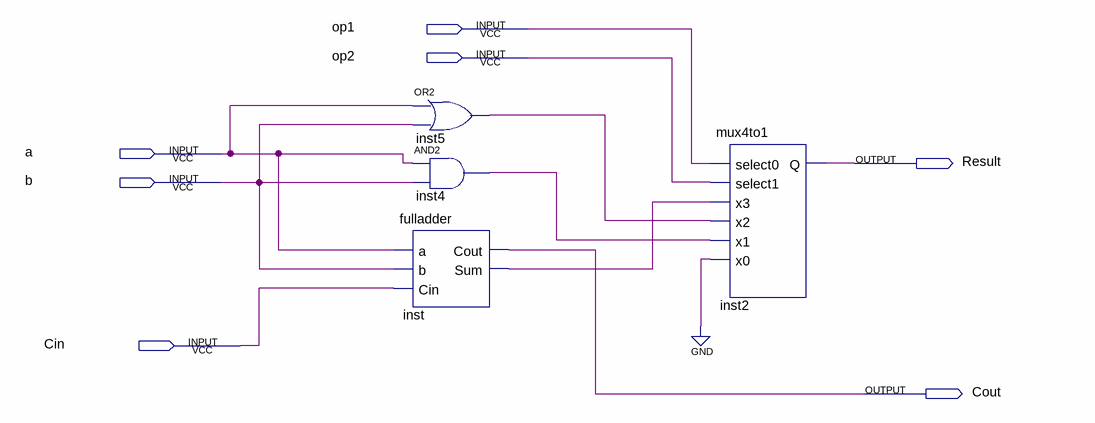
[diagram p0: schematic sheet]
// Quartus schematic alu1bit.bdf as structural Verilog: 4 symbols, 7 pins
module alu1bit (
  input  op1,
  input  op2,
  input  a,
  input  b,
  input  Cin,
  output Result,
  output Cout
);

  wire inst4_out, inst5_out, inst_sum;

  or inst5 (inst5_out, a, b);
  and inst4 (inst4_out, a, b);
  fulladder inst (.a(a), .b(b), .Cin(Cin), .Cout(Cout), .Sum(inst_sum));
  mux4to1 inst2 (.select0(op1), .select1(op2), .x3(inst_sum), .x2(inst5_out), .x1(inst4_out), .x0(1'b0), .Q(Result));
endmodule
